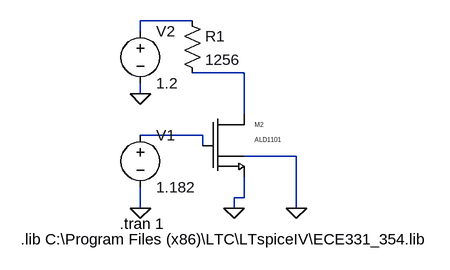
[diagram p0: schematic Draft1-3.asc]
Draft1-3.asc, the LTspice schematic file:
Version 4
SHEET 1 880 680
WIRE 16 0 -64 0
WIRE -64 16 -64 0
WIRE 96 80 16 80
WIRE -64 112 -64 96
WIRE 96 144 96 80
WIRE 32 176 -64 176
WIRE 32 192 32 176
WIRE 176 208 96 208
WIRE 96 272 96 240
WIRE 96 272 80 272
WIRE -64 288 -64 256
WIRE 80 288 80 272
WIRE 176 288 176 208
FLAG 80 288 0
FLAG -64 288 0
FLAG -64 112 0
FLAG 176 288 0
SYMBOL voltage -64 160 R0
WINDOW 123 0 0 Left 2
WINDOW 39 0 0 Left 2
SYMATTR InstName V1
SYMATTR Value 1.182
SYMBOL voltage -64 0 R0
WINDOW 123 0 0 Left 2
WINDOW 39 0 0 Left 2
SYMATTR InstName V2
SYMATTR Value 1.2
SYMBOL res 0 -16 R0
SYMATTR InstName R1
SYMATTR Value 1256
SYMBOL ALD1101 32 144 R0
SYMATTR InstName M2
TEXT -96 312 Left 2 !.tran 1
TEXT -248 336 Left 2 !.lib C:\\Program Files (x86)\\LTC\\LTspiceIV\\ECE331_354.lib

The netlist it stands for:
* Draft1-3.asc
V1 N003 0 1.182
V2 N001 0 1.2
R1 N001 N002 1256
M2 N002 N003 0 0 ALD1101 W=1.379e-3 L=1E-6
.model NMOS NMOS
.model PMOS PMOS
.lib standard.mos
.tran 1
.lib C:\Program Files (x86)\LTC\LTspiceIV\ECE331_354.lib
.backanno
.end